# Altium schematic sheet MAZ000187 - Diagrama eléctrico.SchDoc: MAZ000187 - Diagrama eléctrico
size A; ApprovedBy: Christian Ledwidth; CheckedBy: Nahuel Martinez; Author: Santiago Marti; CompanyName: Body Health; DrawnBy: Santiago Marti; Revision: A; SheetNumber: 1; SheetTotal: 2
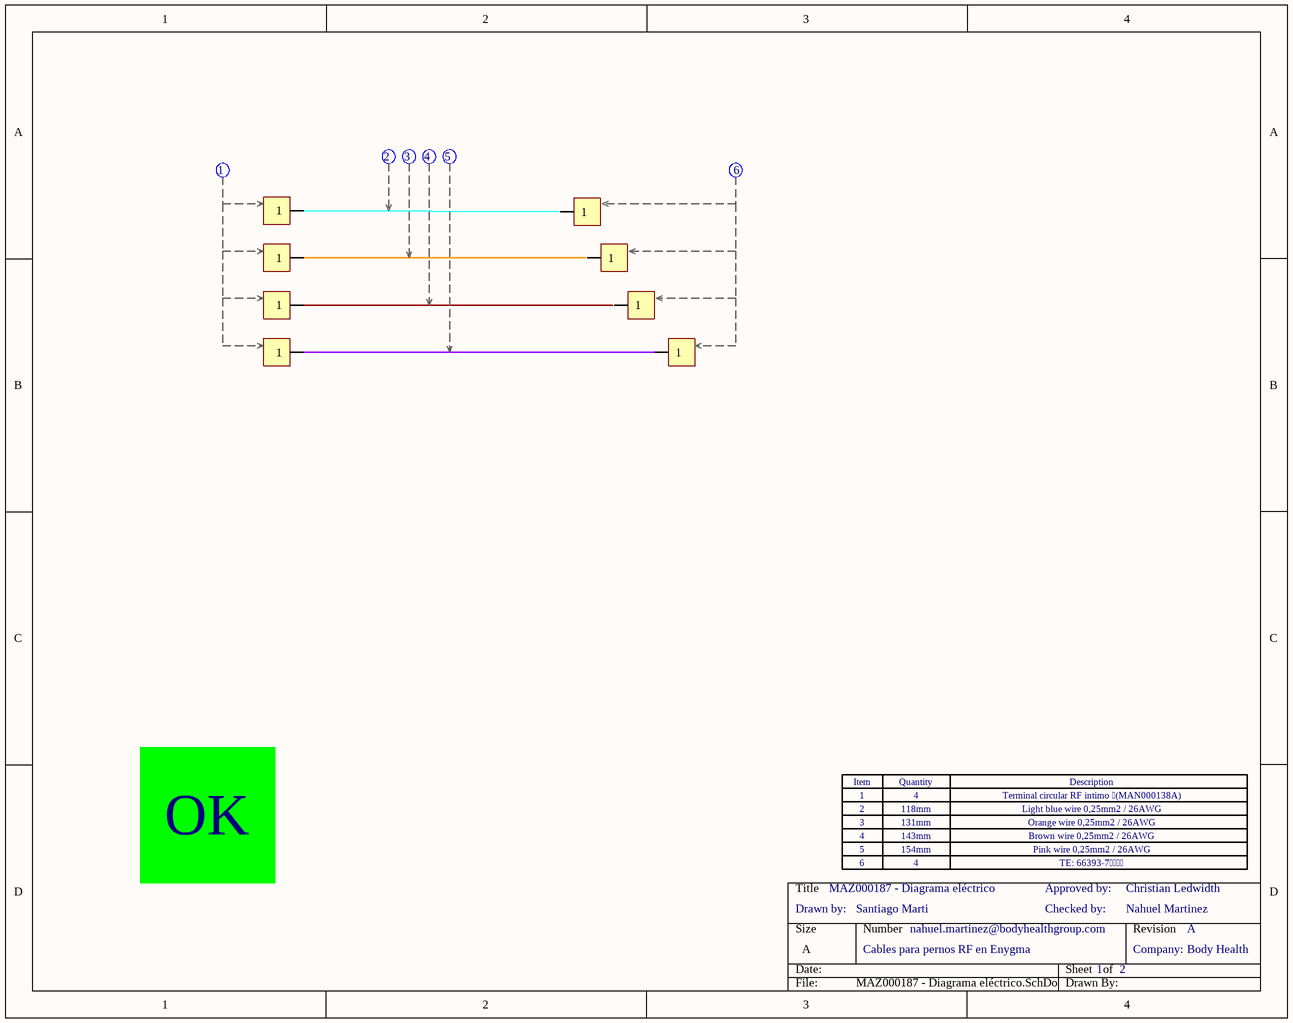
[diagram p0: MAZ000187 - Diagrama eléctrico.SchDoc]

## Parts
(Parts that share a designator on the sheet are numbered #1, #2 ... from top to bottom, then left to right.)
Con?#1  Ring  (value not drawn)  (part D of 4)
Con?#2  Ring  (value not drawn)  (part D of 4)
Con?#3  Ring  (value not drawn)  (part D of 4)
Con?#4  Ring  (value not drawn)  (part D of 4)
Con?#5  Ring  (value not drawn)  (part D of 4)
Con?#6  Ring  (value not drawn)  (part D of 4)
Con?#7  Ring  (value not drawn)  (part D of 4)
Con?#8  Ring  (value not drawn)  (part D of 4)
Ter?#1  Termocontraible  (value not drawn)
Ter?#2  Termocontraible  (value not drawn)
Ter?#3  Termocontraible  (value not drawn)
Ter?#4  Termocontraible  (value not drawn)
Ter?#5  Termocontraible  (value not drawn)
Ter?#6  Termocontraible  (value not drawn)
Zoc1  Zócalo_Header  (value not drawn)
Zoc2  Zócalo_Item  (value not drawn)
Zoc3  Zócalo_Item  (value not drawn)
Zoc4  Zócalo_Item  (value not drawn)
Zoc5  Zócalo_Item  (value not drawn)
Zoc?#1  Zócalo_Item  (value not drawn)
Zoc?#2  Zócalo_Item  (value not drawn)

## Nets

Not connected (* = marked no-connect by the designer): Con?#1 1; Con?#2 1; Con?#3 1; Con?#4 1; Con?#5 1; Con?#6 1; Con?#7 1; Con?#8 1

## Notes on the sheet
- OK
- 1
- 2
- 3
- 4
- 118mm
- 131mm
- 143mm
- Terminal circular RF intimo (MAN000138A)
- Light blue wire 0,25mm2 / 26AWG
- Orange wire 0,25mm2 / 26AWG
- Brown wire 0,25mm2 / 26AWG
- (near Zoc?#2) Drawn by:
- 5
- (near Zoc?#1) 6
- 154mm
- Checked by:
- Approved by:
- Pink wire 0,25mm2 / 26AWG
- TE: 66393-7
- Cables para pernos RF en Enygma
- nahuel.martinez@bodyhealthgroup.com
- Company:
- (in symbol Zócalo_Header) Item; Quantity; Description

## Library data of the parts
Con?#1-Con?#8 = Ring: CONN HOUSING RING M4; Cod.DigiKey: -; Cod.Fabricante: -; ComponentLink1Description: Manufacturer Link; ComponentLink1URL: -; DIGIKEYx50: -; Fabricante: -; CallOut: *; DIGIKEYx100: -
Ter?#1 = Termocontraible: CallOut: 2; Largo: *; Diámetro: *
Ter?#2 = Termocontraible: CallOut: 3; Largo: *; Diámetro: *
Ter?#3 = Termocontraible: CallOut: 4; Largo: *; Diámetro: *
Ter?#4 = Termocontraible: CallOut: 5; Largo: *; Diámetro: *
Ter?#5 = Termocontraible: CallOut: 1; Largo: *; Diámetro: *
Ter?#6 = Termocontraible: CallOut: 6; Largo: *; Diámetro: *
Zoc1 = Zócalo_Header: Header para el zócalo de referencias
Zoc2-Zoc5 Zoc?#1 Zoc?#2 = Zócalo_Item: Ítem para el zócalo de referencias; Desginator: *; Quantity: *; ItemDescription: *